# EAGLE schematic RF-detector (EAGLE 8.3.1)
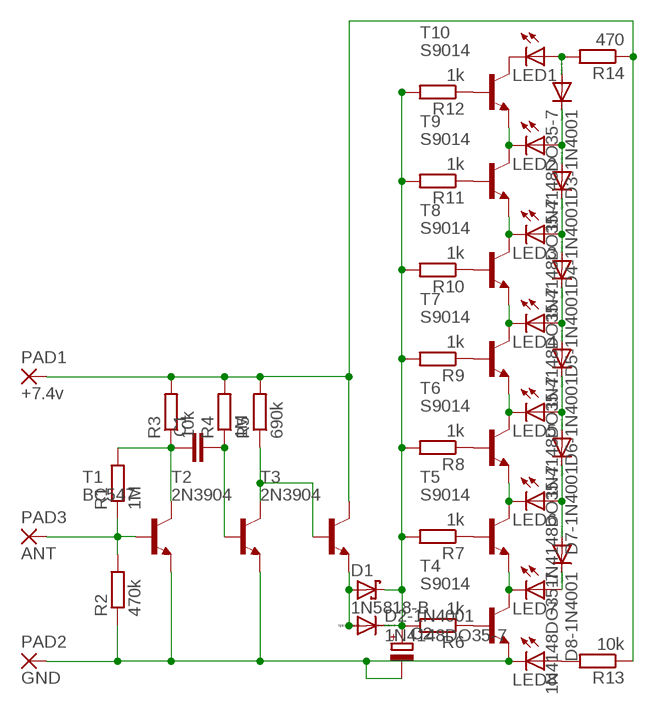
[diagram p0: schematic, sheet 1]

## Parts
C1  C-EU050-024X044  [C050-024X044]
C2  CPOL-EUE1.8-4  [E1,8-4]
D1  1N5818-B  [DO41-7.6]
D2-1N4001  1N4148DO35-7  [DO35-7]
D3-1N4001  1N4148DO35-7  [DO35-7]
D4-1N4001  1N4148DO35-7  [DO35-7]
D5-1N4001  1N4148DO35-7  [DO35-7]
D6-1N4001  1N4148DO35-7  [DO35-7]
D7-1N4001  1N4148DO35-7  [DO35-7]
D8-1N4001  1N4148DO35-7  [DO35-7]
LED1  LED3MM  [LED3MM]
LED2  LED3MM  [LED3MM]
LED3  LED3MM  [LED3MM]
LED4  LED3MM  [LED3MM]
LED5  LED3MM  [LED3MM]
LED6  LED3MM  [LED3MM]
LED7  LED3MM  [LED3MM]
LED8  LED3MM  [LED3MM]
PAD1  +7.4v  2,54/0,8  [2,54/0,8]
PAD2  GND  2,54/0,8  [2,54/0,8]
PAD3  ANT  2,54/0,8  [2,54/0,8]
R1  1M  R-EU_0204/7  [0204/7]
R2  470k  R-EU_0204/7  [0204/7]
R3  10k  R-EU_0204/7  [0204/7]
R4  1M  R-EU_0204/7  [0204/7]
R5  690k  R-EU_0204/7  [0204/7]
R6  1k  R-EU_0204/7  [0204/7]
R7  1k  R-EU_0204/7  [0204/7]
R8  1k  R-EU_0204/7  [0204/7]
R9  1k  R-EU_0204/7  [0204/7]
R10  1k  R-EU_0204/7  [0204/7]
R11  1k  R-EU_0204/7  [0204/7]
R12  1k  R-EU_0204/7  [0204/7]
R13  10k  R-EU_0204/7  [0204/7]
R14  470  R-EU_0204/7  [0204/7]
T1  BC547  [TO92]
T2  2N3904  [TO92]
T3  2N3904  [TO92]
T4  S9014  -NPN-TO92-EBC  [TO92-EBC]
T5  S9014  -NPN-TO92-EBC  [TO92-EBC]
T6  S9014  -NPN-TO92-EBC  [TO92-EBC]
T7  S9014  -NPN-TO92-EBC  [TO92-EBC]
T8  S9014  -NPN-TO92-EBC  [TO92-EBC]
T9  S9014  -NPN-TO92-EBC  [TO92-EBC]
T10  S9014  -NPN-TO92-EBC  [TO92-EBC]

## Nets
N$1: PAD3.1(P) R1.1 R2.2 T1.2(B)
N$2: C1.1 R1.2 R3.1 T1.3(C)
N$3: C1.2 R4.1 T2.2(B)
N$4: R5.1 T2.1(C) T3.2(B)
N$5: PAD1.1(P) R3.2 R4.2 R5.2 R13.1 R14.1 T3.1(C)
N$7: C2.- LED8.K(C) PAD2.1(P) R2.1 T1.1(E) T2.3(E) T4.E
N$8: D1.A D2-1N4001.A T3.3(E)
N$9: R6.1 T4.B
N$10: C2.+ D1.C D2-1N4001.C R6.2 R7.2 R8.2 R9.2 R10.2 R11.2 R12.2
N$11: R7.1 T5.B
N$12: R8.1 T6.B
N$13: R9.1 T7.B
N$14: R10.1 T8.B
N$15: R11.1 T9.B
N$16: R12.1 T10.B
N$17: LED2.K(C) T9.C T10.E
N$18: LED3.K(C) T8.C T9.E
N$19: LED4.K(C) T7.C T8.E
N$20: LED5.K(C) T6.C T7.E
N$21: LED6.K(C) T5.C T6.E
N$22: LED7.K(C) T4.C T5.E
N$23: LED1.K(C) T10.C
N$24: D3-1N4001.A LED1.A R14.2
N$25: D3-1N4001.C D4-1N4001.A LED2.A
N$26: D4-1N4001.C D5-1N4001.A LED3.A
N$27: D5-1N4001.C D6-1N4001.A LED4.A
N$28: D6-1N4001.C D7-1N4001.A LED5.A
N$29: D7-1N4001.C D8-1N4001.A LED6.A
N$30: D8-1N4001.C LED7.A
N$31: LED8.A R13.2

## Library data of the parts
C1 = resistor:C-EU: CAPACITOR, European symbol
C2 = resistor:CPOL-EU: POLARIZED CAPACITOR, European symbol
D1 = diode:1N581*: 1.0A SCHOTTKY BARRIER RECTIFIER Source: http://www.diodes.com/datasheets/ds23001.pdf
D2-1N4001 D3-1N4001 D4-1N4001 D5-1N4001 D6-1N4001 D7-1N4001 D8-1N4001 = diode:1N4148: DIODE high speed (Philips)
LED1-LED8 = led:LED: LED OSRAM: - CHIPLED LG R971, LG N971, LY N971, LG Q971, LY Q971, LO R971, LY R971 LH N974, LH R974 LS Q976, LO Q976, LY Q976 LO Q996 - Hyper CHIPLED LW Q18S LB Q993, LB Q99A, LB R99A - SideLED LS A670, LO A670, LY A670, LG A670, LP A670 LB A673, LV A673, LT A673, LW A673 LH A674 LY A675 LS A676, LA A676, LO A676, LY A676, LW A676 LS A679, LY A679, LG A679 - Hyper Micro SIDELED® LS Y876, LA Y876, LO Y876, LY Y876 LT Y87S - SmartLED LW L88C, LW L88S LB L89C, LB L89S, LG L890 LS L89K, LO L89K, LY L89K LS L896, LA L896, LO L896, LY L896 - TOPLED LS T670, LO T670, LY T670, LG T670, LP T670 LSG T670, LSP T670, LSY T670, LOP T670, LYG T670 LG T671, LOG T671, LSG T671 LB T673, LV T673, LT T673, LW T673 LH T674 LS T676, LA T676, LO T676, LY T676, LB T676, LH T676, LSB T676, LW T676 LB T67C, LV T67C, LT T67C, LS T67K, LO T67K, LY T67K, LW E67C LS E67B, LA E67B, LO E67B, LY E67B, LB E67C, LV E67C, LT E67C LW T67C LS T679, LY T679, LG T679 LS T770, LO T770, LY T770, LG T770, LP T770 LB T773, LV T773, LT T773, LW T773 LH T774 LS E675, LA E675, LY E675, LS T675 LS T776, LA T776, LO T776, LY T776, LB T776 LHGB T686 LT T68C, LB T68C - Hyper Mini TOPLED® LB M676 - Mini TOPLED Santana® LG M470 LS M47K, LO M47K, LY M47K Source: http://www.osram.convergy.de LUXEON: - LUMILED® LXK2-PW12-R00, LXK2-PW12-S00, LXK2-PW14-U00, LXK2-PW14-V00 LXK2-PM12-R00, LXK2-PM12-S00, LXK2-PM14-U00 LXK2-PE12-Q00, LXK2-PE12-R00, LXK2-PE12-S00, LXK2-PE14-T00, LXK2-PE14-U00 LXK2-PB12-K00, LXK2-PB12-L00, LXK2-PB12-M00, LXK2-PB14-N00, LXK2-PB14-P00, LXK2-PB14-Q00 LXK2-PR12-L00, LXK2-PR12-M00, LXK2-PR14-Q00, LXK2-PR14-R00 LXK2-PD12-Q00, LXK2-PD12-R00, LXK2-PD12-S00 LXK2-PH12-R00, LXK2-PH12-S00 LXK2-PL12-P00, LXK2-PL12-Q00, LXK2-PL12-R00 Source: www.luxeon.com KINGBRIGHT: KA-3528ASYC Source: www.kingbright.com
PAD1-PAD3 = wirepad:2,54/0,8: THROUGH-HOLE PAD
R1-R14 = resistor:R-EU_: RESISTOR, European symbol
T1 = transistor:BC547: NPN TRANSISTOR
T2 T3 = transistor:2N3904: NPN TRANSISTOR
T4-T10 = transistor:*-NPN-: NPN Transistror BF959 corrected 2008.03.06